# EAGLE design Motherboard V3.1 (EAGLE 6.5.0)

## Sheet 1 of 2: Bank Arbitration and Buss
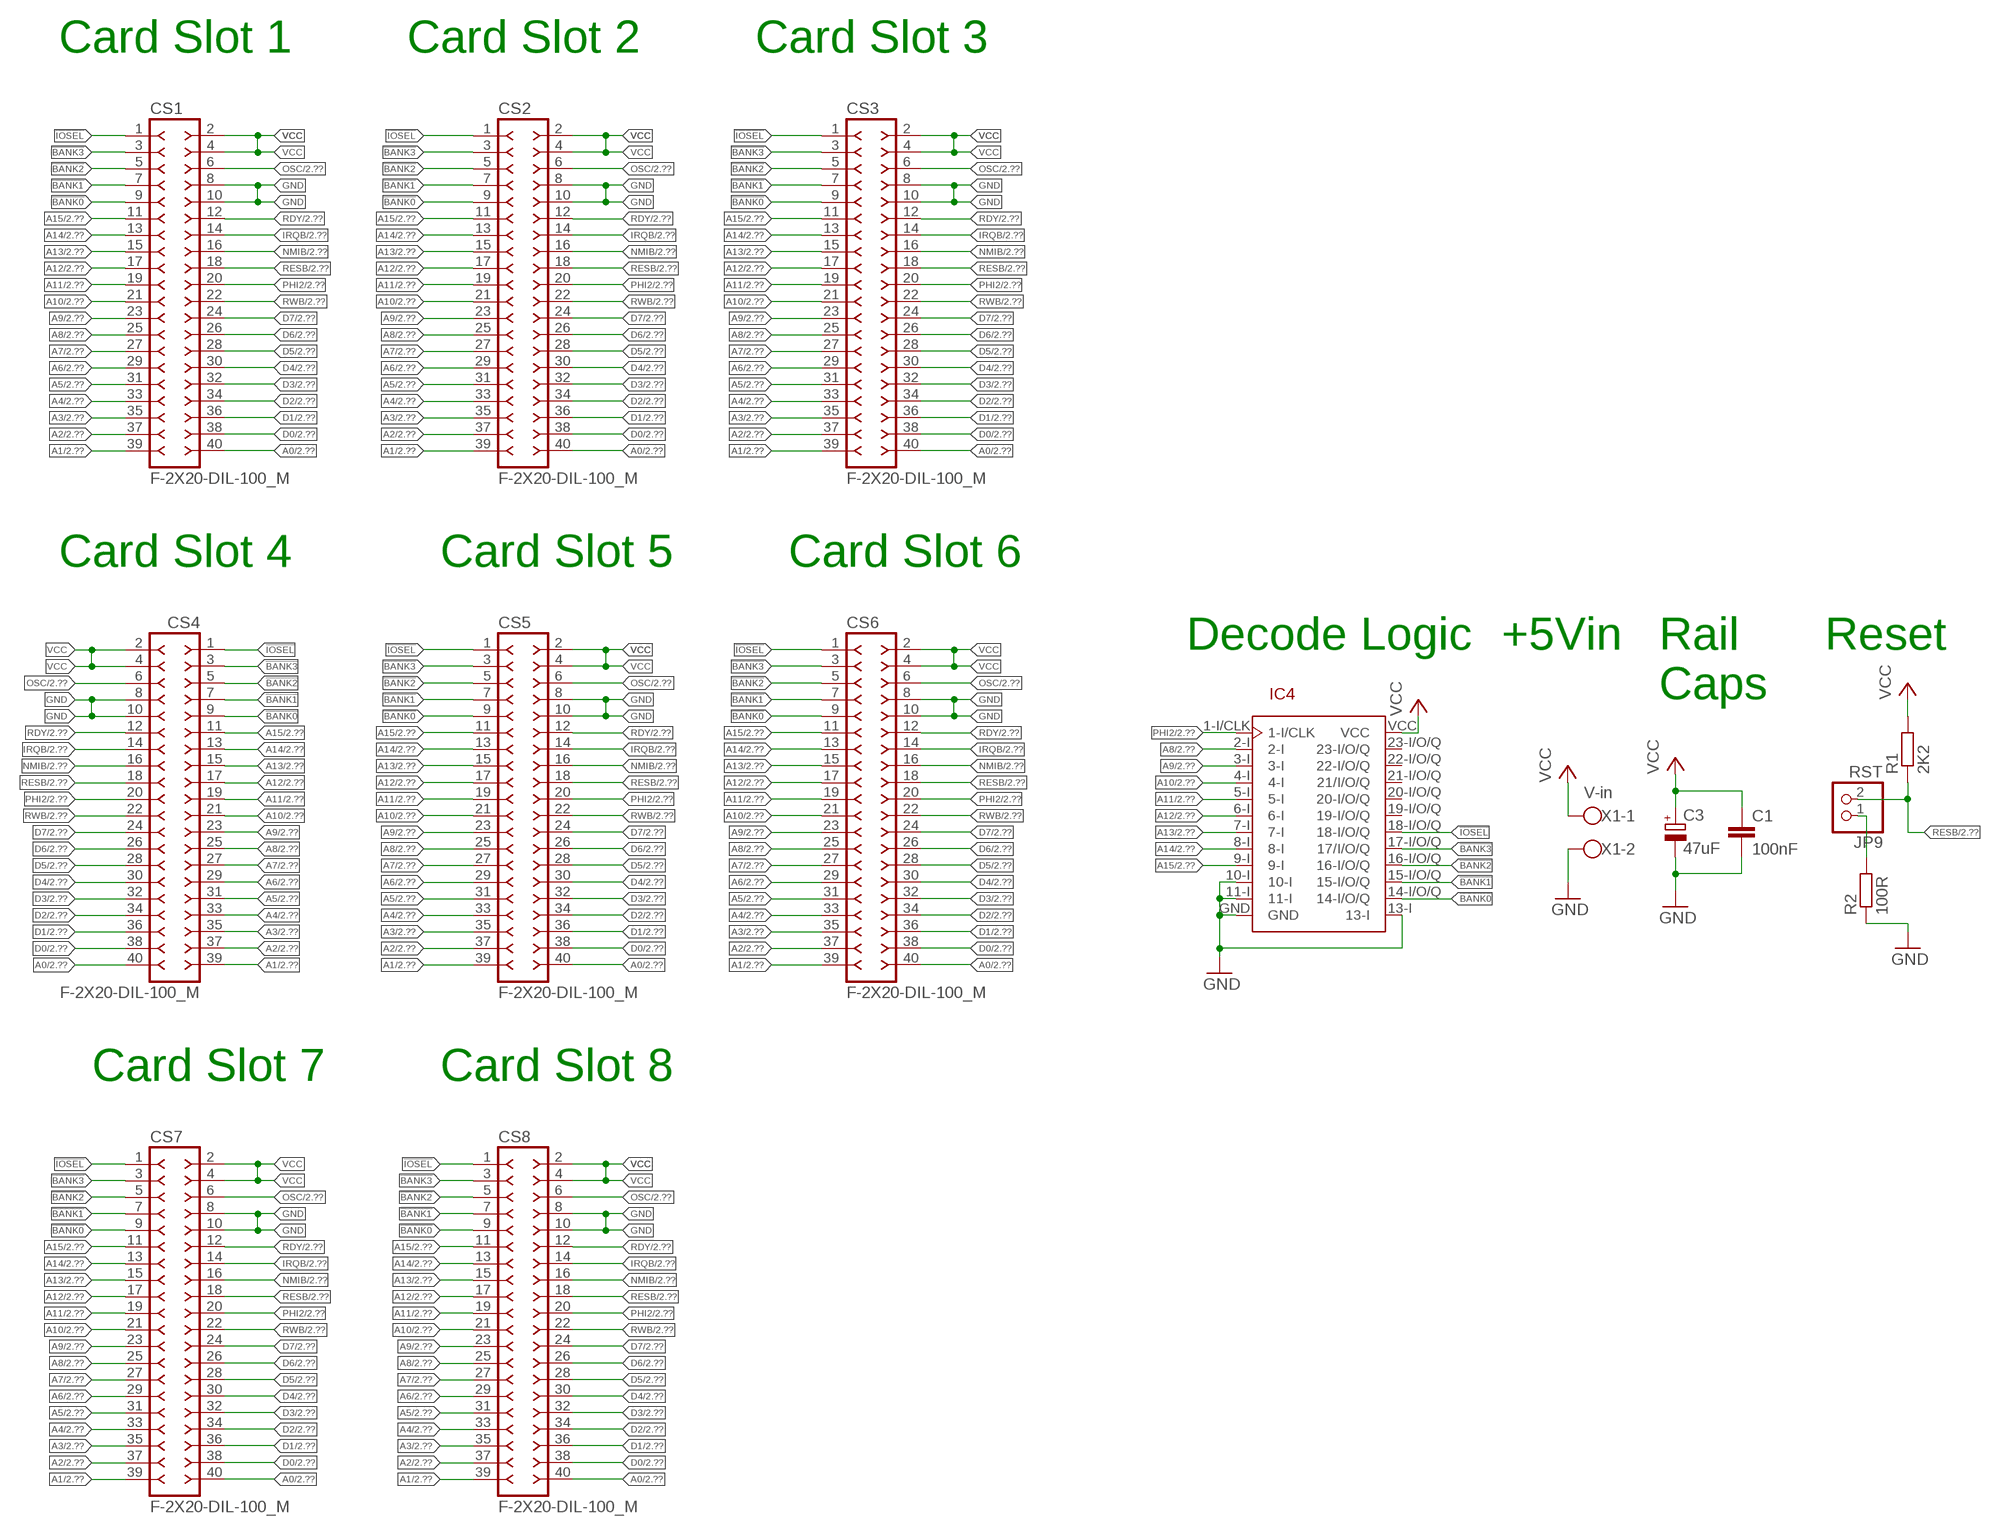
[diagram p0: schematic, sheet 1]

### Parts
C1  100nF  C-EU050-025X075  [C050-025X075]
C3  47uF  CPOL-EUE2.5-7  [E2,5-7]
CS1  F-2X20-DIL-100_M  [DIL-100-2X20_M]
CS2  F-2X20-DIL-100_M  [DIL-100-2X20_M]
CS3  F-2X20-DIL-100_M  [DIL-100-2X20_M]
CS4  F-2X20-DIL-100_M  [DIL-100-2X20_M]
CS5  F-2X20-DIL-100_M  [DIL-100-2X20_M]
CS6  F-2X20-DIL-100_M  [DIL-100-2X20_M]
CS7  F-2X20-DIL-100_M  [DIL-100-2X20_M]
CS8  F-2X20-DIL-100_M  [DIL-100-2X20_M]
IC4  GAL22V10D-7LP  GAL22V10D-DIP  [DIP24]
JP9  RST  PINHD-1X2  [1X02]
R1  2K2  R-EU_0207/10  [0207/10]
R2  100R  R-EU_0207/10  [0207/10]
X1  V-in  W237-102  [W237-102]

### Nets
!BANK0: CS1.9 CS2.9 CS3.9 CS4.9 CS5.9 CS6.9 CS7.9 CS8.9 IC4.14-I/O/Q
!BANK1: CS1.7 CS2.7 CS3.7 CS4.7 CS5.7 CS6.7 CS7.7 CS8.7 IC4.15-I/O/Q
!BANK2: CS1.5 CS2.5 CS3.5 CS4.5 CS5.5 CS6.5 CS7.5 CS8.5 IC4.16-I/O/Q
!BANK3: CS1.3 CS2.3 CS3.3 CS4.3 CS5.3 CS6.3 CS7.3 CS8.3 IC4.17-I/O/Q(17/I/O/Q)
!IOSEL: CS1.1 CS2.1 CS3.1 CS4.1 CS5.1 CS6.1 CS7.1 CS8.1 IC4.18-I/O/Q
A0: CS1.40 CS2.40 CS3.40 CS4.40 CS5.40 CS6.40 CS7.40 CS8.40 ; also sheet 2
A1: CS1.39 CS2.39 CS3.39 CS4.39 CS5.39 CS6.39 CS7.39 CS8.39 ; also sheet 2
A2: CS1.37 CS2.37 CS3.37 CS4.37 CS5.37 CS6.37 CS7.37 CS8.37 ; also sheet 2
A3: CS1.35 CS2.35 CS3.35 CS4.35 CS5.35 CS6.35 CS7.35 CS8.35 ; also sheet 2
A4: CS1.33 CS2.33 CS3.33 CS4.33 CS5.33 CS6.33 CS7.33 CS8.33 ; also sheet 2
A5: CS1.31 CS2.31 CS3.31 CS4.31 CS5.31 CS6.31 CS7.31 CS8.31 ; also sheet 2
A6: CS1.29 CS2.29 CS3.29 CS4.29 CS5.29 CS6.29 CS7.29 CS8.29 ; also sheet 2
A7: CS1.27 CS2.27 CS3.27 CS4.27 CS5.27 CS6.27 CS7.27 CS8.27 ; also sheet 2
A8: CS1.25 CS2.25 CS3.25 CS4.25 CS5.25 CS6.25 CS7.25 CS8.25 IC4.2-I ; also sheet 2
A9: CS1.23 CS2.23 CS3.23 CS4.23 CS5.23 CS6.23 CS7.23 CS8.23 IC4.3-I ; also sheet 2
A10: CS1.21 CS2.21 CS3.21 CS4.21 CS5.21 CS6.21 CS7.21 CS8.21 IC4.4-I ; also sheet 2
A11: CS1.19 CS2.19 CS3.19 CS4.19 CS5.19 CS6.19 CS7.19 CS8.19 IC4.5-I ; also sheet 2
A12: CS1.17 CS2.17 CS3.17 CS4.17 CS5.17 CS6.17 CS7.17 CS8.17 IC4.6-I ; also sheet 2
A13: CS1.15 CS2.15 CS3.15 CS4.15 CS5.15 CS6.15 CS7.15 CS8.15 IC4.7-I ; also sheet 2
A14: CS1.13 CS2.13 CS3.13 CS4.13 CS5.13 CS6.13 CS7.13 CS8.13 IC4.8-I ; also sheet 2
A15: CS1.11 CS2.11 CS3.11 CS4.11 CS5.11 CS6.11 CS7.11 CS8.11 IC4.9-I ; also sheet 2
D0: CS1.38 CS2.38 CS3.38 CS4.38 CS5.38 CS6.38 CS7.38 CS8.38 ; also sheet 2
D1: CS1.36 CS2.36 CS3.36 CS4.36 CS5.36 CS6.36 CS7.36 CS8.36 ; also sheet 2
D2: CS1.34 CS2.34 CS3.34 CS4.34 CS5.34 CS6.34 CS7.34 CS8.34 ; also sheet 2
D3: CS1.32 CS2.32 CS3.32 CS4.32 CS5.32 CS6.32 CS7.32 CS8.32 ; also sheet 2
D4: CS1.30 CS2.30 CS3.30 CS4.30 CS5.30 CS6.30 CS7.30 CS8.30 ; also sheet 2
D5: CS1.28 CS2.28 CS3.28 CS4.28 CS5.28 CS6.28 CS7.28 CS8.28 ; also sheet 2
D6: CS1.26 CS2.26 CS3.26 CS4.26 CS5.26 CS6.26 CS7.26 CS8.26 ; also sheet 2
D7: CS1.24 CS2.24 CS3.24 CS4.24 CS5.24 CS6.24 CS7.24 CS8.24 ; also sheet 2
GND: C1.2 C3.- CS1.8 CS1.10 CS2.8 CS2.10 CS3.8 CS3.10 CS4.8 CS4.10 CS5.8 CS5.10 CS6.8 CS6.10 CS7.8 CS7.10 CS8.8 CS8.10 IC4.10-I IC4.11-I IC4.13-I IC4.GND R2.1 X1.2 ; also sheet 2
IRQB: CS1.14 CS2.14 CS3.14 CS4.14 CS5.14 CS6.14 CS7.14 CS8.14 ; also sheet 2
N$1: JP9.1 R2.2
NMIB: CS1.16 CS2.16 CS3.16 CS4.16 CS5.16 CS6.16 CS7.16 CS8.16 ; also sheet 2
OSC: CS1.6 CS2.6 CS3.6 CS4.6 CS5.6 CS6.6 CS7.6 CS8.6 ; also sheet 2
PHI2: CS1.20 CS2.20 CS3.20 CS4.20 CS5.20 CS6.20 CS7.20 CS8.20 IC4.1-I/CLK ; also sheet 2
RDY: CS1.12 CS2.12 CS3.12 CS4.12 CS5.12 CS6.12 CS7.12 CS8.12 ; also sheet 2
RESB: CS1.18 CS2.18 CS3.18 CS4.18 CS5.18 CS6.18 CS7.18 CS8.18 JP9.2 R1.1 ; also sheet 2
RWB: CS1.22 CS2.22 CS3.22 CS4.22 CS5.22 CS6.22 CS7.22 CS8.22 ; also sheet 2
VCC: C1.1 C3.+ CS1.2 CS1.4 CS2.2 CS2.4 CS3.2 CS3.4 CS4.2 CS4.4 CS5.2 CS5.4 CS6.2 CS6.4 CS7.2 CS7.4 CS8.2 CS8.4 IC4.VCC R1.2 X1.1 ; also sheet 2
Unconnected: IC4.19-I/O/Q IC4.20-I/O/Q IC4.21-I/O/Q(21/I/O/Q) IC4.22-I/O/Q IC4.23-I/O/Q

### Notes on the sheet
- Card Slot 1 | Card Slot 2 | Card Slot 3
- Card Slot 4 | Card Slot 5 | Card Slot 6
- Rail
  Caps
- Decode Logic | +5Vin | Reset
- Card Slot 7 | Card Slot 8

## Sheet 2 of 2: Processr, Clock and IRQ/NMI LED Header
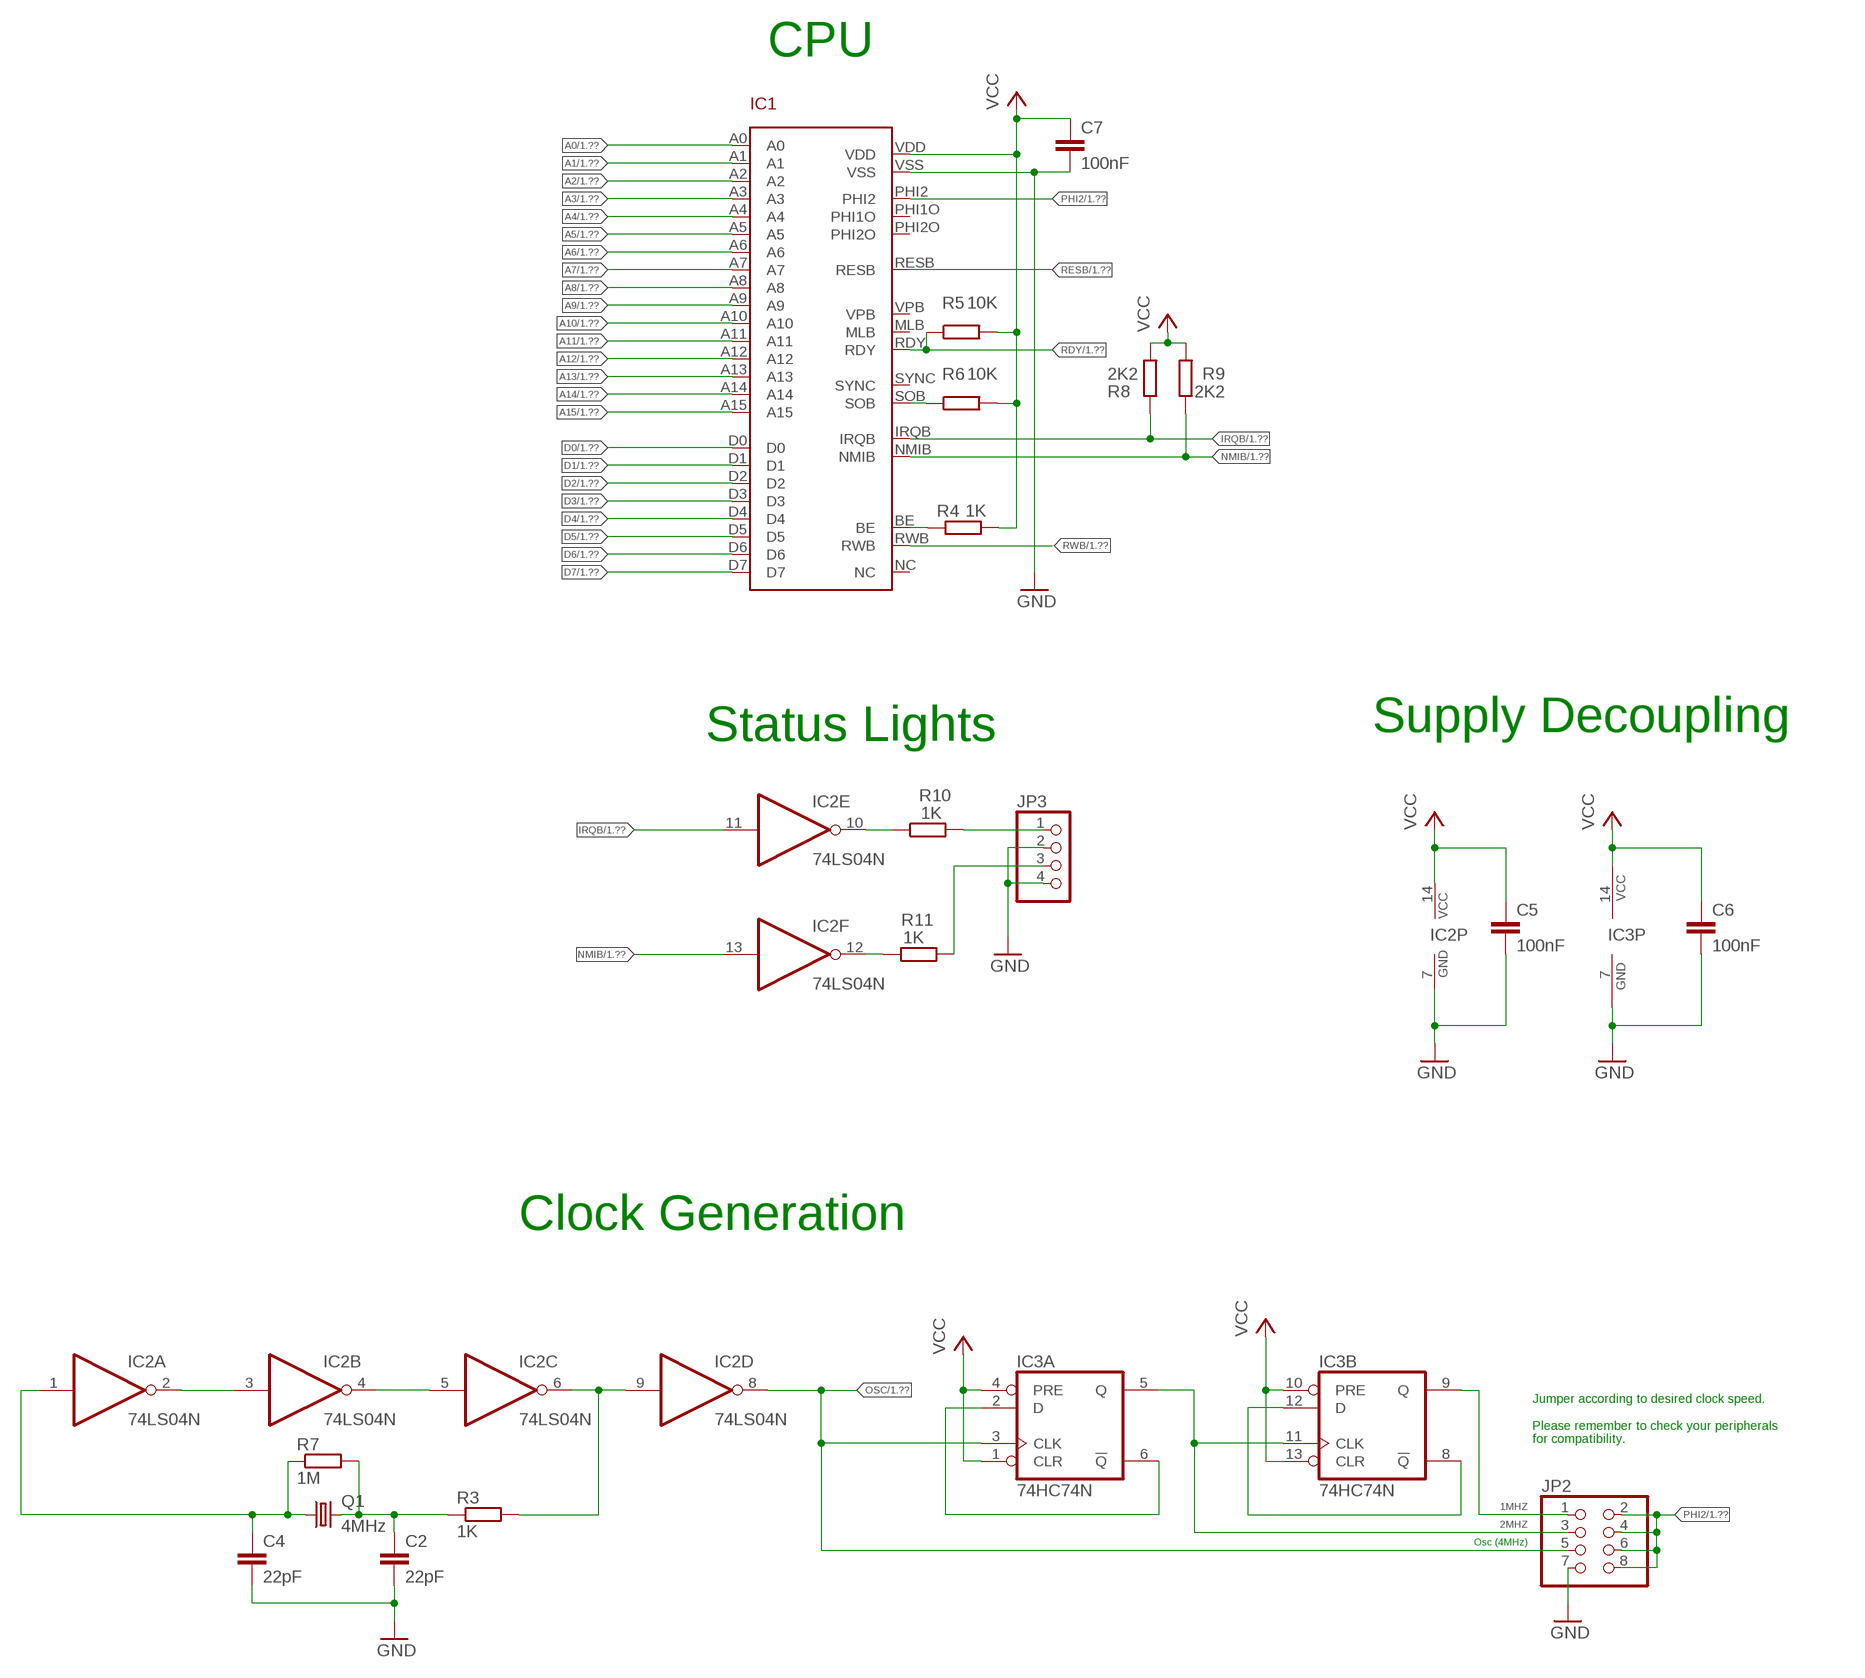
[diagram p1: schematic, sheet 2]

### Parts
C2  22pF  C-EU025-025X050  [C025-025X050]
C4  22pF  C-EU025-025X050  [C025-025X050]
C5  100nF  C-EU050-025X075  [C050-025X075]
C6  100nF  C-EU050-025X075  [C050-025X075]
C7  100nF  C-EU050-025X075  [C050-025X075]
IC1  W65C02S-DIP  [DIP40]
IC2  74LS04N  74HC04N  [DIL14]
IC3  74HC74N  74LS74N  [DIL14]
JP2  PINHD-2X4  [2X04]
JP3  PINHD-1X4  [1X04]
Q1  4MHz  CRYSTALHC49S  [HC49/S]
R3  1K  R-EU_0207/2V  [0207/2V]
R4  1K  R-EU_0207/10  [0207/10]
R5  10K  R-EU_0207/2V  [0207/2V]
R6  10K  R-EU_0207/10  [0207/10]
R7  1M  R-EU_0207/2V  [0207/2V]
R8  2K2  R-EU_0207/2V  [0207/2V]
R9  2K2  R-EU_0207/2V  [0207/2V]
R10  1K  R-EU_0207/2V  [0207/2V]
R11  1K  R-EU_0207/2V  [0207/2V]

### Nets
1MHZ: IC3.9(B:Q) JP2.1
2MHZ: IC3.5(A:Q) IC3.11(B:CLK) JP2.3
A0: IC1.A0 ; also sheet 1
A1: IC1.A1 ; also sheet 1
A2: IC1.A2 ; also sheet 1
A3: IC1.A3 ; also sheet 1
A4: IC1.A4 ; also sheet 1
A5: IC1.A5 ; also sheet 1
A6: IC1.A6 ; also sheet 1
A7: IC1.A7 ; also sheet 1
A8: IC1.A8 ; also sheet 1
A9: IC1.A9 ; also sheet 1
A10: IC1.A10 ; also sheet 1
A11: IC1.A11 ; also sheet 1
A12: IC1.A12 ; also sheet 1
A13: IC1.A13 ; also sheet 1
A14: IC1.A14 ; also sheet 1
A15: IC1.A15 ; also sheet 1
D0: IC1.D0 ; also sheet 1
D1: IC1.D1 ; also sheet 1
D2: IC1.D2 ; also sheet 1
D3: IC1.D3 ; also sheet 1
D4: IC1.D4 ; also sheet 1
D5: IC1.D5 ; also sheet 1
D6: IC1.D6 ; also sheet 1
D7: IC1.D7 ; also sheet 1
GND: C2.2 C4.2 C5.2 C6.2 C7.2 IC1.VSS IC2.7(P:GND) IC3.7(P:GND) JP2.7 JP3.2 JP3.4 ; also sheet 1
IRQ_LED: JP3.1 R10.2
IRQ_SIG: IC2.10(E:O) R10.1
IRQB: IC1.IRQB IC2.11(E:I) R8.1 ; also sheet 1
N$2: IC2.4(B:O) IC2.5(C:I)
N$3: IC2.6(C:O) IC2.9(D:I) R3.2
N$4: C2.1 Q1.2 R3.1 R7.2
N$5: C4.1 IC2.1(A:I) Q1.1 R7.1
N$6: IC3.2(A:D) IC3.6(A:!Q)
N$7: IC2.2(A:O) IC2.3(B:I)
N$8: IC3.8(B:!Q) IC3.12(B:D)
N$15: IC1.BE R4.1
N$16: IC1.SOB R6.1
NMI_LED: JP3.3 R11.2
NMI_SIG: IC2.12(F:O) R11.1
NMIB: IC1.NMIB IC2.13(F:I) R9.1 ; also sheet 1
OSC: IC2.8(D:O) IC3.3(A:CLK) JP2.5 ; also sheet 1
PHI2: IC1.PHI2 JP2.2 JP2.4 JP2.6 JP2.8 ; also sheet 1
RDY: IC1.RDY R5.1 ; also sheet 1
RESB: IC1.RESB ; also sheet 1
RWB: IC1.RWB ; also sheet 1
VCC: C5.1 C6.1 C7.1 IC1.VDD IC2.14(P:VCC) IC3.1(A:CLR) IC3.4(A:PRE) IC3.10(B:PRE) IC3.13(B:CLR) IC3.14(P:VCC) R4.2 R5.2 R6.2 R8.2 R9.2 ; also sheet 1
Unconnected: IC1.MLB IC1.NC IC1.PHI1O IC1.PHI2O IC1.SYNC IC1.VPB

### Notes on the sheet
- CPU
- Status Lights | Supply Decoupling
- Clock Generation
- Jumper according to desired clock speed.
  
  Please remember to check your peripherals
  for compatibility.
- Osc (4MHz)

## Library data of the parts
C1 C2 C4-C7 = rcl:C-EU: CAPACITOR, European symbol
C3 = rcl:CPOL-EU: POLARIZED CAPACITOR, European symbol
CS1-CS8 = con-headers-jp:F-2X20-: FEMALE HEADER
IC1 = W65C02S:W65C02S-DIP
IC2 = 74xx-eu:74*04: Hex INVERTER
IC3 = 74xx-us:74*74: Dual D type positive edge triggered FLIP FLOP, preset and clear
IC4 = GAL22V10D:GAL22V10D-DIP: GAL22V10 Generic Array Logic
JP2 = pinhead:PINHD-2X4: PIN HEADER
JP3 = pinhead:PINHD-1X4: PIN HEADER
JP9 = pinhead:PINHD-1X2: PIN HEADER
Q1 = crystal:CRYSTAL: CRYSTAL; OC_FARNELL: 1667008; OC_NEWARK: unknown
R1-R11 = rcl:R-EU_: RESISTOR, European symbol
X1 = con-wago-500:W237-102: WAGO SCREW CLAMP; MPN: 237-102; OC_FARNELL: unknown; OC_NEWARK: 70K9898

## Board
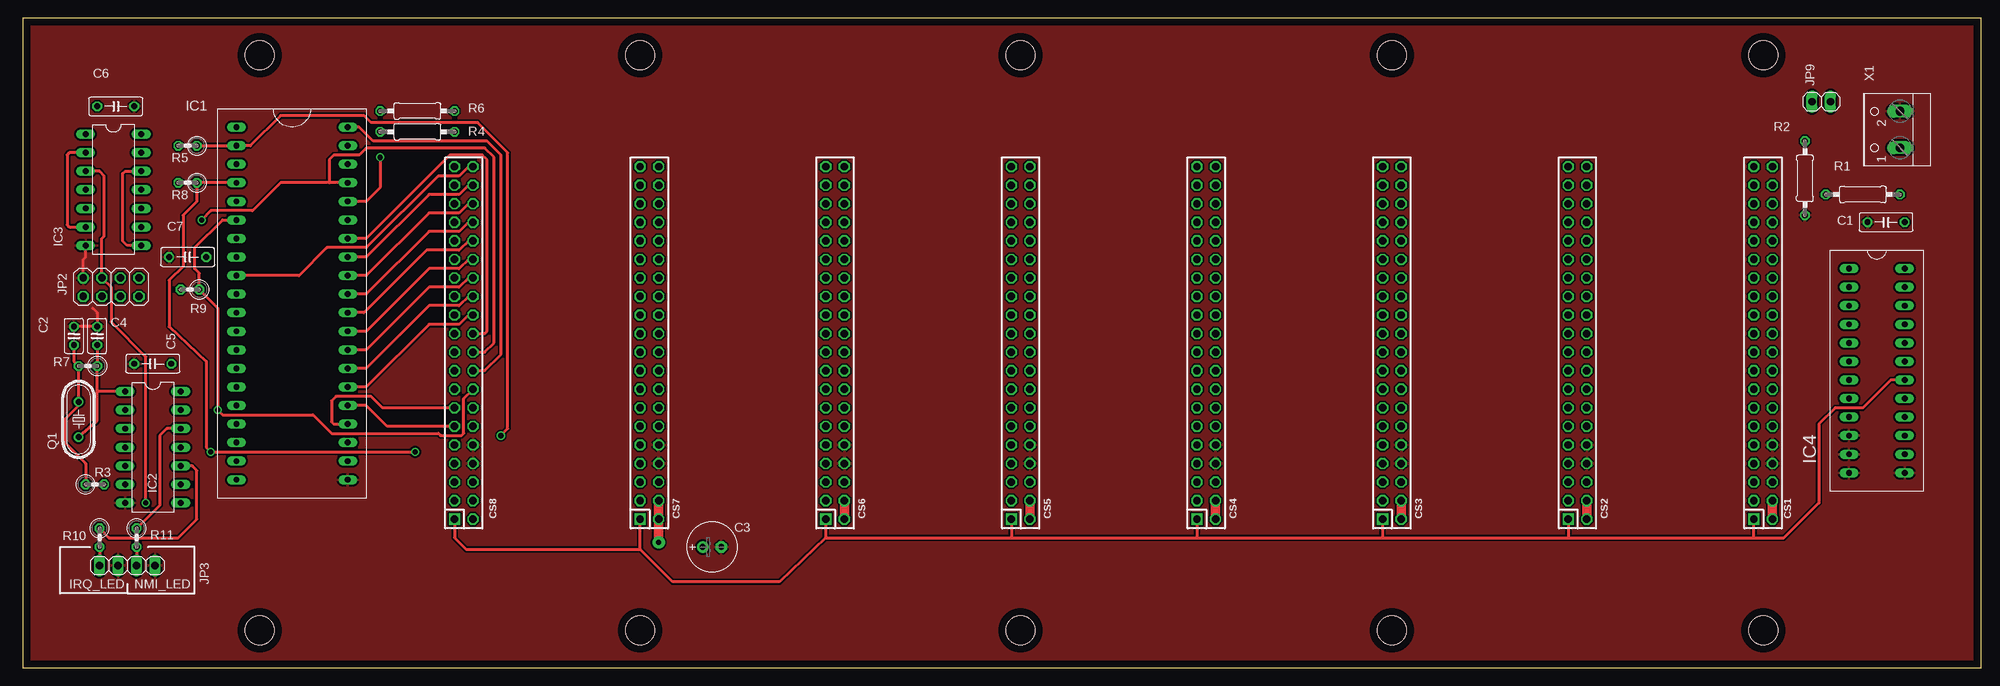
[diagram p2: board, top side]
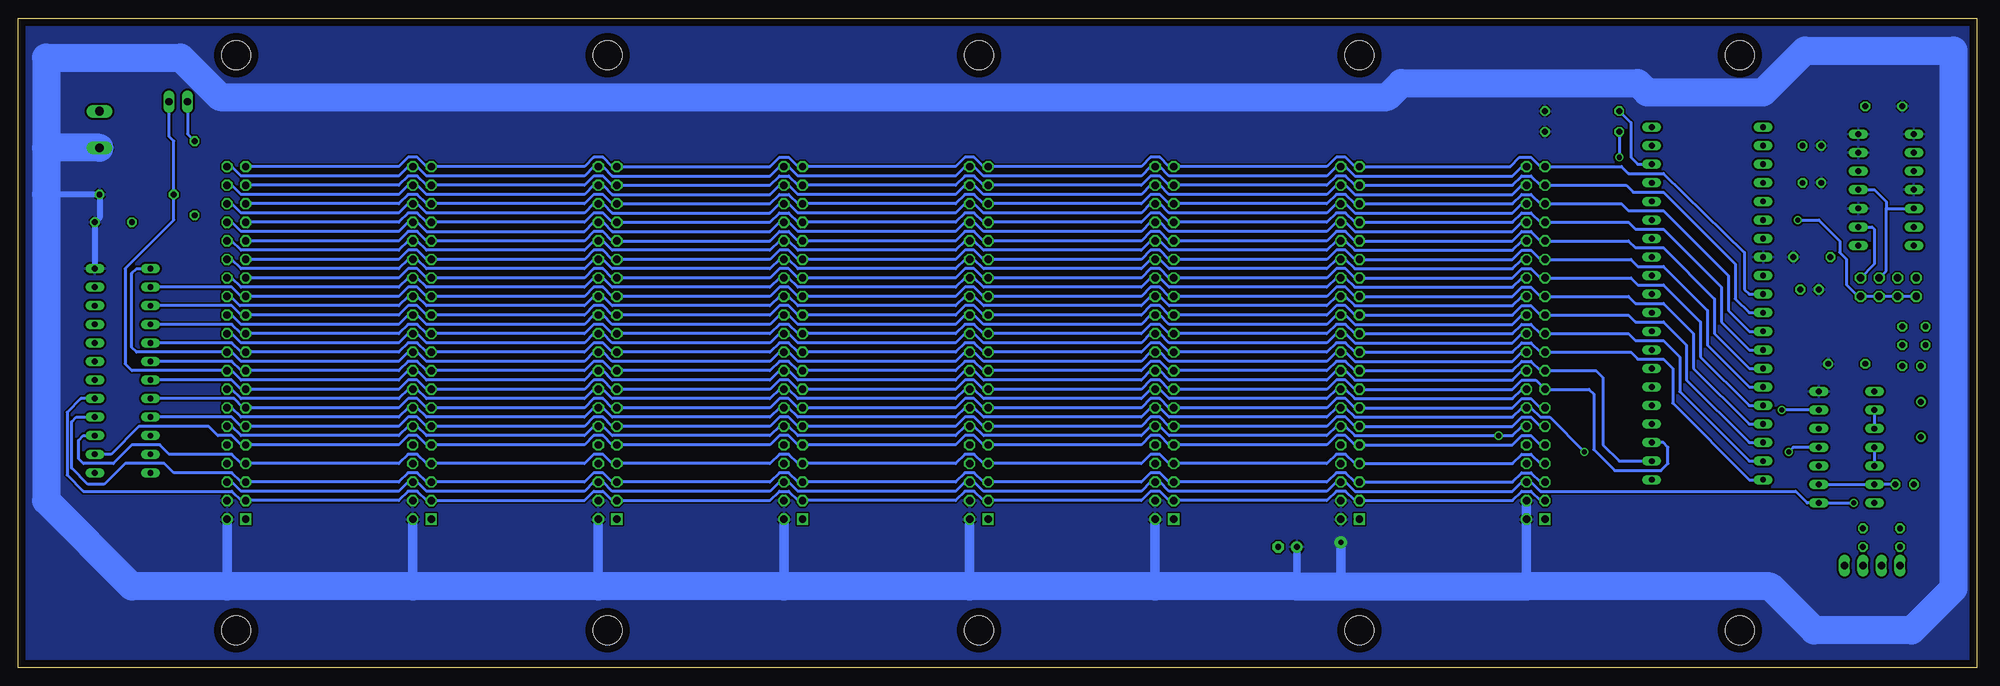
[diagram p3: board, bottom side, seen from below]

Size 267.96 x 88.89 mm. Coordinates in mm from the lower left corner, seen from the top.
Outline: 0,0 267.96,0 267.96,88.89 0,88.89 0,0
Copper layers (1*16): Top 0.07mm / dielectric 1.5mm / Bottom 0.07mm
Design rules "default *": minimum track width 10mil, minimum drill 24mil, track to track 8mil, track to pad 8mil, pad to pad 8mil, via to via 8mil, smd to smd 8mil, copper to edge 40mil, drill to drill 8mil, minimum pad ring 10mil, minimum via ring 8mil, stop-mask expansion 4mil, vias tented up to drill 0mil, thermal gap 10mil
Holes 4 mm at 84.45,5.08 84.45,83.82 238.12,83.82 238.12,5.08 136.53,5.08 136.53,83.82 187.32,5.08 187.32,83.82 84.45,5.08 32.38,5.08 32.38,83.82

### Footprints (pad centres in the part's own frame; a part is rotated, then mirrored left to right if it is on the bottom)
C050-025X075 = drill 0.813 octagon: 1 -2.54,0; 2 2.54,0
C025-025X050 = drill 0.813 octagon: 1 -1.27,0; 2 1.27,0
E2,5-7 = drill 0.813 pad 1.6: + -1.27,0 | drill 0.813 pad 1.6 octagon: - 1.27,0
DIL-100-2X20_M = drill 1.016 square: 1 -24.13,1.27 | drill 1.016 octagon: 2 -24.13,-1.27; 3 -21.59,1.27; 4 -21.59,-1.27; 5 -19.05,1.27; 6 -19.05,-1.27; 7 -16.51,1.27; 8 -16.51,-1.27; 9 -13.97,1.27; 10 -13.97,-1.27; 11 -11.43,1.27; 12 -11.43,-1.27; 13 -8.89,1.27; 14 -8.89,-1.27; 15 -6.35,1.27; 16 -6.35,-1.27; 17 -3.81,1.27; 18 -3.81,-1.27; 19 -1.27,1.27; 20 -1.27,-1.27; 21 1.27,1.27; 22 1.27,-1.27; 23 3.81,1.27; 24 3.81,-1.27; 25 6.35,1.27; 26 6.35,-1.27; 27 8.89,1.27; 28 8.89,-1.27; 29 11.43,1.27; 30 11.43,-1.27; 31 13.97,1.27; 32 13.97,-1.27; 33 16.51,1.27; 34 16.51,-1.27; 35 19.05,1.27; 36 19.05,-1.27; 37 21.59,1.27; 38 21.59,-1.27; 39 24.13,1.27; 40 24.13,-1.27
DIP40 = drill 0.8 long: A0 -7.62,3.81; A1 -7.62,1.27; A2 -7.62,-1.27; A3 -7.62,-3.81; A4 -7.62,-6.35; A5 -7.62,-8.89; A6 -7.62,-11.43; A7 -7.62,-13.97; A8 -7.62,-16.51; A9 -7.62,-19.05; A10 -7.62,-21.59; A11 -7.62,-24.13; A12 7.62,-21.59; A13 7.62,-19.05; A14 7.62,-16.51; A15 7.62,-13.97; BE 7.62,13.97; D0 7.62,6.35; D1 7.62,3.81; D2 7.62,1.27; D3 7.62,-1.27; D4 7.62,-3.81; D5 7.62,-6.35; D6 7.62,-8.89; D7 7.62,-11.43; IRQB -7.62,16.51; MLB -7.62,13.97; NC 7.62,11.43; NMIB -7.62,11.43; PHI1O -7.62,19.05; PHI2 7.62,16.51; PHI2O 7.62,21.59; RDY -7.62,21.59; RESB 7.62,24.13; RWB 7.62,8.89; SOB 7.62,19.05; SYNC -7.62,8.89; VDD -7.62,6.35; VPB -7.62,24.13; VSS 7.62,-24.13
DIL14 = drill 0.813 long: 1 -7.62,-3.81; 2 -5.08,-3.81; 3 -2.54,-3.81; 4 0,-3.81; 5 2.54,-3.81; 6 5.08,-3.81; 7 7.62,-3.81; 8 7.62,3.81; 9 5.08,3.81; 10 2.54,3.81; 11 0,3.81; 12 -2.54,3.81; 13 -5.08,3.81; 14 -7.62,3.81
DIP24 = drill 0.8 long: 1-I/CLK -3.81,13.97; 2-I -3.81,11.43; 3-I -3.81,8.89; 4-I -3.81,6.35; 5-I -3.81,3.81; 6-I -3.81,1.27; 7-I -3.81,-1.27; 8-I -3.81,-3.81; 9-I -3.81,-6.35; 10-I -3.81,-8.89; 11-I -3.81,-11.43; 13-I 3.81,-13.97; 14-I/O/Q 3.81,-11.43; 15-I/O/Q 3.81,-8.89; 16-I/O/Q 3.81,-6.35; 17-I/O/Q 3.81,-3.81; 18-I/O/Q 3.81,-1.27; 19-I/O/Q 3.81,1.27; 20-I/O/Q 3.81,3.81; 21-I/O/Q 3.81,6.35; 22-I/O/Q 3.81,8.89; 23-I/O/Q 3.81,11.43; GND -3.81,-13.97; VCC 3.81,13.97
2X04 = drill 1.016 octagon: 1 -3.81,-1.27; 2 -3.81,1.27; 3 -1.27,-1.27; 4 -1.27,1.27; 5 1.27,-1.27; 6 1.27,1.27; 7 3.81,-1.27; 8 3.81,1.27
1X04 = drill 1.016 long: 1 -3.81,0; 2 -1.27,0; 3 1.27,0; 4 3.81,0
1X02 = drill 1.016 long: 1 -1.27,0; 2 1.27,0
HC49/S = drill 0.813: 1 -2.413,0; 2 2.413,0
0207/10 = drill 0.813 octagon: 1 -5.08,0; 2 5.08,0
0207/2V = drill 0.813 octagon: 1 -1.27,0; 2 1.27,0
W237-102 = drill 1.194 long: 1 -2.5,-1.27; 2 2.5,-1.27

### Placement (x,y rotation side)
C1  254.95,60.96 180 top
C2  6.99,45.4 90 top
C3  94.3,16.51 0 top
C4  10.16,45.4 90 top
C5  17.78,41.59 180 top
C6  12.7,76.83 0 top
C7  22.54,56.2 180 top
CS1  238.12,44.45 90 top
CS2  212.72,44.45 90 top
CS3  187.32,44.45 90 top
CS4  161.93,44.45 90 top
CS5  136.53,44.45 90 top
CS6  111.12,44.45 90 top
CS7  85.72,44.45 90 top
CS8  60.33,44.45 90 top
IC1  36.83,49.85 0 top
IC2  17.78,30.16 270 top
IC3  12.38,65.41 270 top
IC4  253.68,40.64 0 top
JP2  12.06,52.07 180 top
JP3  14.29,13.97 0 top
JP9  246.06,77.47 0 top
Q1  7.62,33.97 90 top
R1  251.78,64.77 0 top
R2  243.84,66.99 90 top
R3  9.84,25.08 0 top
R4  53.98,73.34 0 top
R5  22.54,71.44 180 top
R6  53.98,76.2 0 top
R7  8.89,41.27 180 top
R8  22.54,66.36 180 top
R9  22.86,51.75 180 top
R10  10.48,17.78 270 top
R11  15.56,17.78 270 top
X1  255.59,73.66 90 top

### Tracks (layer width: path | path; a pad name or v marks a point on that pad's centre or on a via)
1MHZ
  Bottom 0.406: IC3.9 14.29,60.33 13.97,60.01 13.97,55.24 JP2.1
2MHZ
  Bottom 0.406: 12.38,62.87 IC3.5 | IC3.11 13.97,65.41 12.38,63.82 12.38,62.87 | JP2.3 12.38,54.29 12.38,62.87
!BANK0
  Bottom 0.406: IC4.14-I/O/Q 255.27,29.21 251.46,33.02 241.94,33.02 240.66,31.75 238.76,31.75 237.49,30.48 CS1.9 215.9,30.48 214.63,31.75 213.36,31.75 212.09,30.48 CS2.9 190.5,30.48 189.23,31.75 187.96,31.75 186.69,30.48 CS3.9 165.1,30.48 163.83,31.75 162.56,31.75 161.29,30.48 CS4.9 139.7,30.48 138.43,31.75 137.16,31.75 135.89,30.48 CS5.9 114.3,30.48 113.03,31.75 111.76,31.75 110.49,30.48 CS6.9 88.9,30.48 87.63,31.75 86.36,31.75 85.09,30.48 CS7.9 63.5,30.48 62.23,31.75 60.96,31.75 59.69,30.48 CS8.9
!BANK1
  Bottom 0.406: IC4.15-I/O/Q 259.08,31.75 259.71,31.11 259.71,28.57 259.08,27.94 254.95,27.94 252.41,30.48 248.6,30.48 247.33,29.21 238.76,29.21 237.49,27.94 CS1.7 215.9,27.94 214.63,29.21 213.36,29.21 212.09,27.94 CS2.7 190.5,27.94 189.23,29.21 187.96,29.21 186.69,27.94 CS3.7 165.1,27.94 163.83,29.21 162.56,29.21 161.29,27.94 CS4.7 139.7,27.94 138.43,29.21 137.16,29.21 135.89,27.94 CS5.7 114.3,27.94 113.03,29.21 111.76,29.21 110.49,27.94 CS6.7 88.9,27.94 87.63,29.21 86.36,29.21 85.09,27.94 CS7.7 63.5,27.94 62.23,29.21 60.96,29.21 59.69,27.94 CS8.7
!BANK2
  Bottom 0.406: IC4.16-I/O/Q 260.03,34.29 260.67,33.66 260.67,27.3 258.44,25.08 256.22,25.08 253.37,27.94 247.97,27.94 246.7,26.67 238.76,26.67 237.49,25.4 CS1.5 215.9,25.4 214.63,26.67 213.36,26.67 212.09,25.4 CS2.5 190.5,25.4 189.23,26.67 187.96,26.67 186.69,25.4 CS3.5 165.1,25.4 163.83,26.67 162.56,26.67 161.29,25.4 CS4.5 139.7,25.4 138.43,26.67 137.16,26.67 135.89,25.4 CS5.5 114.3,25.4 113.03,26.67 111.76,26.67 110.49,25.4 CS6.5 88.9,25.4 87.63,26.67 86.36,26.67 85.09,25.4 CS7.5 63.5,25.4 62.23,26.67 60.96,26.67 59.69,25.4 CS8.5
!BANK3
  Bottom 0.406: IC4.17-I/O/Q 259.4,36.83 261.3,34.92 261.3,26.35 259.08,24.13 238.76,24.13 237.49,22.86 CS1.3 215.9,22.86 214.63,24.13 213.36,24.13 212.09,22.86 CS2.3 190.5,22.86 189.23,24.13 187.96,24.13 186.69,22.86 CS3.3 165.1,22.86 163.83,24.13 162.56,24.13 161.29,22.86 CS4.3 139.7,22.86 138.43,24.13 137.16,24.13 135.89,22.86 CS5.3 114.3,22.86 113.03,24.13 111.76,24.13 110.49,22.86 CS6.3 88.9,22.86 87.63,24.13 86.36,24.13 85.09,22.86 CS7.3 63.5,22.86 62.23,24.13 60.96,24.13 59.69,22.86 CS8.3
!IOSEL
  Top 0.406: CS6.1 109.86,17.78 | 109.86,17.78 135.25,17.78 | 135.25,17.78 160.66,17.78 | 160.66,17.78 186.06,17.78 | 186.06,17.78 211.46,17.78 | 211.46,17.78 236.85,17.78 | 236.85,17.78 CS1.1 | CS2.1 211.46,17.78 | CS3.1 186.06,17.78 | CS4.1 160.66,17.78 | CS5.1 135.25,17.78 | 109.86,17.78 103.5,11.75 88.9,11.75 84.45,16.19 | 84.45,16.19 CS7.1 | 236.85,17.78 240.98,17.78 245.75,22.54 245.75,33.34 247.97,35.56 251.78,35.56 255.59,39.37 IC4.18-I/O/Q | CS8.1 59.05,17.78 60.64,16.19 84.45,16.19
A0
  Top 0.406: CS8.40 60.96,68.58 59.69,67.31 56.83,67.31 46.99,57.47 41.59,57.47 37.78,53.66 IC1.A0
  Bottom 0.406: CS1.40 238.76,68.58 237.49,67.31 215.9,67.31 214.63,68.58 CS2.40 213.36,68.58 212.09,67.31 190.5,67.31 189.23,68.58 CS3.40 187.96,68.58 186.69,67.31 165.1,67.31 163.83,68.58 CS4.40 162.56,68.58 161.29,67.31 139.7,67.31 138.43,68.58 CS5.40 137.16,68.58 135.89,67.31 114.3,67.31 113.03,68.58 CS6.40 111.76,68.58 110.49,67.31 88.9,67.31 87.63,68.58 CS7.40 86.36,68.58 85.09,67.31 63.5,67.31 62.23,68.58 CS8.40
A1
  Bottom 0.406: CS1.39 215.9,68.58 214.63,69.85 213.36,69.85 212.09,68.58 CS2.39 190.5,68.58 189.23,69.85 187.96,69.85 186.69,68.58 CS3.39 165.1,68.58 163.83,69.85 162.56,69.85 161.29,68.58 CS4.39 139.7,68.58 138.43,69.85 137.16,69.85 135.89,68.58 CS5.39 114.3,68.58 113.03,69.85 111.76,69.85 110.49,68.58 CS6.39 88.9,68.58 87.63,69.85 86.36,69.85 85.09,68.58 CS7.39 63.82,68.58 62.55,69.85 60.96,69.85 59.69,68.58 CS8.39 48.58,68.58 47.62,67.63 42.86,67.63 31.75,56.83 31.75,51.75 31.11,51.12 IC1.A1
A2
  Bottom 0.406: CS1.37 215.9,66.04 214.63,67.31 213.36,67.31 212.09,66.04 CS2.37 190.5,66.04 189.23,67.31 187.96,67.31 186.69,66.04 CS3.37 165.1,66.04 163.83,67.31 162.56,67.31 161.29,66.04 CS4.37 139.7,66.04 138.43,67.31 137.16,67.31 135.89,66.04 CS5.37 114.3,66.04 113.03,67.31 111.76,67.31 110.49,66.04 CS6.37 88.9,66.04 87.63,67.31 86.36,67.31 85.09,66.04 CS7.37 63.5,66.04 62.23,67.31 60.96,67.31 59.69,66.04 CS8.37 47.94,66.04 46.99,65.09 42.86,65.09 33.02,55.24 33.02,50.48 31.11,48.58 IC1.A2
A3
  Bottom 0.406: CS1.35 215.9,63.5 214.63,64.77 213.36,64.77 212.09,63.5 CS2.35 190.5,63.5 189.23,64.77 187.96,64.77 186.69,63.5 CS3.35 165.1,63.5 163.83,64.77 162.56,64.77 161.29,63.5 CS4.35 139.7,63.5 138.43,64.77 137.16,64.77 135.89,63.5 CS5.35 114.3,63.5 113.03,64.77 111.76,64.77 110.49,63.5 CS6.35 88.9,63.5 87.63,64.77 86.36,64.77 85.09,63.5 CS7.35 63.5,63.5 62.23,64.77 60.96,64.77 59.69,63.5 CS8.35 48.58,63.5 47.62,62.55 42.86,62.55 33.97,53.66 33.97,48.9 31.11,46.04 IC1.A3
A4
  Bottom 0.406: CS1.33 215.9,60.96 214.63,62.23 213.36,62.23 212.09,60.96 CS2.33 190.5,60.96 189.23,62.23 187.96,62.23 186.69,60.96 CS3.33 165.1,60.96 163.83,62.23 162.56,62.23 161.29,60.96 CS4.33 139.7,60.96 138.43,62.23 137.16,62.23 135.89,60.96 CS5.33 114.3,60.96 113.03,62.23 111.76,62.23 110.49,60.96 CS6.33 88.9,60.96 87.63,62.23 86.36,62.23 85.09,60.96 CS7.33 63.5,60.96 62.23,62.23 60.96,62.23 59.69,60.96 CS8.33 47.62,60.96 46.67,60.01 42.86,60.01 34.92,52.07 34.92,47.31 31.11,43.5 IC1.A4
A5
  Bottom 0.406: CS1.31 215.9,58.42 214.63,59.69 213.36,59.69 212.09,58.42 CS2.31 190.5,58.42 189.23,59.69 187.96,59.69 186.69,58.42 CS3.31 165.1,58.42 163.83,59.69 162.56,59.69 161.29,58.42 CS4.31 139.7,58.42 138.43,59.69 137.16,59.69 135.89,58.42 CS5.31 114.3,58.42 113.03,59.69 111.76,59.69 110.49,58.42 CS6.31 88.9,58.42 87.63,59.69 86.36,59.69 85.09,58.42 CS7.31 63.5,58.42 62.23,59.69 60.96,59.69 59.69,58.42 CS8.31 47.62,58.42 46.67,57.47 42.86,57.47 35.88,50.48 35.88,45.72 31.11,40.96 IC1.A5
A6
  Bottom 0.406: CS1.29 215.9,55.88 214.63,57.15 213.36,57.15 212.09,55.88 CS2.29 190.5,55.88 189.23,57.15 187.96,57.15 186.69,55.88 CS3.29 165.1,55.88 163.83,57.15 162.56,57.15 161.29,55.88 CS4.29 139.7,55.88 138.43,57.15 137.16,57.15 135.89,55.88 CS5.29 114.3,55.88 113.03,57.15 111.76,57.15 110.49,55.88 CS6.29 88.9,55.88 87.63,57.15 86.36,57.15 85.09,55.88 CS7.29 63.5,55.88 62.23,57.15 60.96,57.15 59.69,55.88 CS8.29 47.31,55.88 46.35,54.93 42.86,54.93 36.83,48.9 36.83,44.13 31.11,38.42 IC1.A6
A7
  Bottom 0.406: CS1.27 215.9,53.34 214.63,54.61 213.36,54.61 212.09,53.34 CS2.27 190.5,53.34 189.23,54.61 187.96,54.61 186.69,53.34 CS3.27 165.1,53.34 163.83,54.61 162.56,54.61 161.29,53.34 CS4.27 139.7,53.34 138.43,54.61 137.16,54.61 135.89,53.34 CS5.27 114.3,53.34 113.03,54.61 111.76,54.61 110.49,53.34 CS6.27 88.9,53.34 87.63,54.61 86.36,54.61 85.09,53.34 CS7.27 63.5,53.34 62.23,54.61 60.96,54.61 59.69,53.34 CS8.27 47.31,53.34 46.35,52.39 42.86,52.39 37.78,47.31 37.78,42.55 31.11,35.88 IC1.A7
A8
  Bottom 0.406: IC4.2-I 238.76,52.07 237.49,50.8 CS1.25 215.9,50.8 214.63,52.07 213.36,52.07 212.09,50.8 CS2.25 190.5,50.8 189.23,52.07 187.96,52.07 186.69,50.8 CS3.25 165.1,50.8 163.83,52.07 162.56,52.07 161.29,50.8 CS4.25 139.7,50.8 138.43,52.07 137.16,52.07 135.89,50.8 CS5.25 114.3,50.8 113.03,52.07 111.76,52.07 110.49,50.8 CS6.25 88.9,50.8 87.63,52.07 86.36,52.07 85.09,50.8 CS7.25 63.5,50.8 62.23,52.07 60.96,52.07 59.69,50.8 CS8.25 47.62,50.8 46.67,49.85 42.86,49.85 38.73,45.72 38.73,40.96 31.11,33.34 IC1.A8
A9
  Bottom 0.406: IC4.3-I 238.76,49.53 237.49,48.26 CS1.23 215.9,48.26 214.63,49.53 213.36,49.53 212.09,48.26 CS2.23 190.5,48.26 189.23,49.53 187.96,49.53 186.69,48.26 CS3.23 165.1,48.26 163.83,49.53 162.56,49.53 161.29,48.26 CS4.23 139.7,48.26 138.43,49.53 137.16,49.53 135.89,48.26 CS5.23 114.3,48.26 113.03,49.53 111.76,49.53 110.49,48.26 CS6.23 88.9,48.26 87.63,49.53 86.36,49.53 85.09,48.26 CS7.23 63.5,48.26 62.23,49.53 60.96,49.53 59.69,48.26 CS8.23 47.62,48.26 46.67,47.31 42.86,47.31 39.69,44.13 39.69,39.37 31.11,30.8 IC1.A9
A10
  Bottom 0.406: IC4.4-I 238.76,46.99 237.49,45.72 CS1.21 215.9,45.72 214.63,46.99 213.36,46.99 212.09,45.72 CS2.21 190.5,45.72 189.23,46.99 187.96,46.99 186.69,45.72 CS3.21 165.1,45.72 163.83,46.99 162.56,46.99 161.29,45.72 CS4.21 139.7,45.72 138.43,46.99 137.16,46.99 135.89,45.72 CS5.21 114.3,45.72 113.03,46.99 111.76,46.99 110.49,45.72 CS6.21 88.9,45.72 87.63,46.99 86.36,46.99 85.09,45.72 CS7.21 63.5,45.72 62.23,46.99 60.96,46.99 59.69,45.72 CS8.21 47.62,45.72 46.67,44.77 42.86,44.77 40.64,42.55 40.64,37.78 31.11,28.26 IC1.A10
A11
  Bottom 0.406: IC4.5-I 238.76,44.45 237.49,43.18 CS1.19 215.9,43.18 214.63,44.45 213.36,44.45 212.09,43.18 CS2.19 190.5,43.18 189.23,44.45 187.96,44.45 186.69,43.18 CS3.19 165.1,43.18 163.83,44.45 162.56,44.45 161.29,43.18 CS4.19 139.7,43.18 138.43,44.45 137.16,44.45 135.89,43.18 CS5.19 114.3,43.18 113.03,44.45 111.76,44.45 110.49,43.18 CS6.19 88.9,43.18 87.63,44.45 86.36,44.45 85.09,43.18 CS7.19 63.5,43.18 62.23,44.45 60.96,44.45 59.69,43.18 CS8.19 47.31,43.18 46.35,42.23 42.86,42.23 41.59,40.96 41.59,36.2 31.11,25.72 IC1.A11
A12
  Bottom 0.406: IC4.6-I 238.76,41.91 237.49,40.64 CS1.17 215.9,40.64 214.63,41.91 213.36,41.91 212.09,40.64 CS2.17 190.5,40.64 189.23,41.91 187.96,41.91 186.69,40.64 CS3.17 165.1,40.64 163.83,41.91 162.56,41.91 161.29,40.64 CS4.17 139.7,40.64 138.43,41.91 137.16,41.91 135.89,40.64 CS5.17 114.3,40.64 113.03,41.91 111.76,41.91 110.49,40.64 CS6.17 88.9,40.64 87.63,41.91 86.36,41.91 85.09,40.64 CS7.17 63.5,40.64 62.23,41.91 60.96,41.91 59.69,40.64 CS8.17 52.07,40.64 51.12,39.69 51.12,30.48 48.9,28.26 IC1.A12
A13
  Bottom 0.406: IC4.7-I 238.76,39.37 237.49,38.1 CS1.15 215.9,38.1 214.63,39.37 213.36,39.37 212.09,38.1 CS2.15 190.5,38.1 189.23,39.37 187.96,39.37 186.69,38.1 CS3.15 165.1,38.1 163.83,39.37 162.56,39.37 161.29,38.1 CS4.15 139.7,38.1 138.43,39.37 137.16,39.37 135.89,38.1 CS5.15 114.3,38.1 113.03,39.37 111.76,39.37 110.49,38.1 CS6.15 88.9,38.1 87.63,39.37 86.36,39.37 85.09,38.1 CS7.15 63.5,38.1 62.23,39.37 60.33,39.37 CS8.15 53.02,38.1 52.39,37.47 52.39,29.84 49.53,26.99 43.18,26.99 42.23,27.94 42.23,30.16 42.86,30.8 IC1.A13
A14
  Top 0.406: CS8.13 49.21,35.56 47.62,37.15 42.86,37.15 42.23,36.51 42.23,33.66 42.55,33.34 IC1.A14
  Bottom 0.406: IC4.8-I 238.44,36.83 237.17,35.56 CS1.13 215.9,35.56 214.63,36.83 213.36,36.83 212.09,35.56 CS2.13 190.5,35.56 189.23,36.83 187.96,36.83 186.69,35.56 CS3.13 165.1,35.56 163.83,36.83 162.56,36.83 161.29,35.56 CS4.13 139.7,35.56 138.43,36.83 137.16,36.83 135.89,35.56 CS5.13 114.3,35.56 113.03,36.83 111.76,36.83 110.49,35.56 CS6.13 88.9,35.56 87.63,36.83 86.36,36.83 85.09,35.56 CS7.13 63.5,35.56 62.23,36.83 60.96,36.83 59.69,35.56 CS8.13
A15
  Top 0.406: CS8.11 49.85,33.02 46.99,35.88 IC1.A15
  Bottom 0.406: IC4.9-I 238.76,34.29 237.49,33.02 CS1.11 215.9,33.02 214.63,34.29 213.36,34.29 212.09,33.02 CS2.11 190.5,33.02 189.23,34.29 187.96,34.29 186.69,33.02 CS3.11 165.1,33.02 163.83,34.29 162.56,34.29 161.29,33.02 CS4.11 139.7,33.02 138.43,34.29 137.16,34.29 135.89,33.02 CS5.11 114.3,33.02 113.03,34.29 111.76,34.29 110.49,33.02 CS6.11 88.9,33.02 87.63,34.29 86.36,34.29 85.09,33.02 CS7.11 63.5,33.02 62.23,34.29 60.96,34.29 59.69,33.02 CS8.11
D0
  Top 0.406: CS8.38 60.96,66.04 59.69,64.77 55.56,64.77 46.99,56.2 IC1.D0
  Bottom 0.406: CS1.38 238.76,66.04 237.49,64.77 215.9,64.77 214.63,66.04 CS2.38 213.36,66.04 212.09,64.77 190.5,64.77 189.23,66.04 CS3.38 187.96,66.04 186.69,64.77 165.1,64.77 163.83,66.04 CS4.38 162.56,66.04 161.29,64.77 139.7,64.77 138.43,66.04 CS5.38 137.16,66.04 135.89,64.77 114.3,64.77 113.03,66.04 CS6.38 111.76,66.04 110.49,64.77 88.9,64.77 87.63,66.04 CS7.38 86.36,66.04 85.09,64.77 63.5,64.77 62.23,66.04 CS8.38
D1
  Top 0.406: CS8.36 60.96,63.5 59.69,62.23 55.56,62.23 46.99,53.66 IC1.D1
  Bottom 0.406: CS1.36 238.76,63.5 237.49,62.23 215.9,62.23 214.63,63.5 CS2.36 213.36,63.5 212.09,62.23 190.5,62.23 189.23,63.5 CS3.36 187.96,63.5 186.69,62.23 165.1,62.23 163.83,63.5 CS4.36 162.56,63.5 161.29,62.23 139.7,62.23 138.43,63.5 CS5.36 137.16,63.5 135.89,62.23 114.3,62.23 113.03,63.5 CS6.36 111.76,63.5 110.49,62.23 88.9,62.23 87.63,63.5 CS7.36 86.36,63.5 85.09,62.23 63.5,62.23 62.23,63.5 CS8.36
D2
  Top 0.406: CS8.34 60.96,60.96 59.69,59.69 55.56,59.69 46.99,51.12 IC1.D2
  Bottom 0.406: CS1.34 238.76,60.96 237.49,59.69 215.9,59.69 214.63,60.96 CS2.34 213.36,60.96 212.09,59.69 190.5,59.69 189.23,60.96 CS3.34 187.96,60.96 186.69,59.69 165.1,59.69 163.83,60.96 CS4.34 162.56,60.96 161.29,59.69 139.7,59.69 138.43,60.96 CS5.34 137.16,60.96 135.89,59.69 114.3,59.69 113.03,60.96 CS6.34 111.76,60.96 110.49,59.69 88.9,59.69 87.63,60.96 CS7.34 86.36,60.96 85.09,59.69 63.5,59.69 62.23,60.96 CS8.34
D3
  Top 0.406: CS8.32 60.96,58.42 59.69,57.15 55.24,57.15 46.67,48.58 IC1.D3
  Bottom 0.406: CS1.32 238.76,58.42 237.49,57.15 215.9,57.15 214.63,58.42 CS2.32 213.36,58.42 212.09,57.15 190.5,57.15 189.23,58.42 CS3.32 187.96,58.42 186.69,57.15 165.1,57.15 163.83,58.42 CS4.32 162.56,58.42 161.29,57.15 139.7,57.15 138.43,58.42 CS5.32 137.16,58.42 135.89,57.15 114.3,57.15 113.03,58.42 CS6.32 111.76,58.42 110.49,57.15 88.9,57.15 87.63,58.42 CS7.32 86.36,58.42 85.09,57.15 63.5,57.15 62.23,58.42 CS8.32
D4
  Top 0.406: CS8.30 60.96,55.88 59.69,54.61 55.56,54.61 46.99,46.04 IC1.D4
  Bottom 0.406: CS1.30 238.76,55.88 237.49,54.61 215.9,54.61 214.63,55.88 CS2.30 213.36,55.88 212.09,54.61 190.5,54.61 189.23,55.88 CS3.30 187.96,55.88 186.69,54.61 165.1,54.61 163.83,55.88 CS4.30 162.56,55.88 161.29,54.61 139.7,54.61 138.43,55.88 CS5.30 137.16,55.88 135.89,54.61 114.3,54.61 113.03,55.88 CS6.30 111.76,55.88 110.49,54.61 88.9,54.61 87.63,55.88 CS7.30 86.36,55.88 85.09,54.61 63.5,54.61 62.23,55.88 CS8.30
D5
  Top 0.406: CS8.28 60.96,53.34 59.69,52.07 55.56,52.07 46.99,43.5 IC1.D5
  Bottom 0.406: CS1.28 238.76,53.34 237.49,52.07 215.9,52.07 214.63,53.34 CS2.28 213.36,53.34 212.09,52.07 190.5,52.07 189.23,53.34 CS3.28 187.96,53.34 186.69,52.07 165.1,52.07 163.83,53.34 CS4.28 162.56,53.34 161.29,52.07 139.7,52.07 138.43,53.34 CS5.28 137.16,53.34 135.89,52.07 114.3,52.07 113.03,53.34 CS6.28 111.76,53.34 110.49,52.07 88.9,52.07 87.63,53.34 CS7.28 86.36,53.34 85.09,52.07 63.5,52.07 62.23,53.34 CS8.28
D6
  Top 0.406: CS8.26 60.96,50.8 59.69,49.53 55.56,49.53 46.99,40.96 IC1.D6
  Bottom 0.406: CS1.26 238.92,50.8 237.65,49.53 215.9,49.53 214.63,50.8 CS2.26 213.36,50.8 212.09,49.53 190.5,49.53 189.23,50.8 CS3.26 187.96,50.8 186.69,49.53 165.1,49.53 163.83,50.8 CS4.26 162.56,50.8 161.29,49.53 139.7,49.53 138.43,50.8 CS5.26 137.16,50.8 135.89,49.53 114.3,49.53 113.03,50.8 CS6.26 111.76,50.8 110.49,49.53 88.9,49.53 87.63,50.8 CS7.26 86.36,50.8 85.09,49.53 63.5,49.53 62.23,50.8 CS8.26
D7
  Top 0.406: CS8.24 60.96,48.26 59.69,46.99 55.56,46.99 46.99,38.42 IC1.D7
  Bottom 0.406: CS1.24 238.76,48.26 237.49,46.99 215.9,46.99 214.63,48.26 CS2.24 213.36,48.26 212.09,46.99 190.5,46.99 189.23,48.26 CS3.24 187.96,48.26 186.69,46.99 165.1,46.99 163.83,48.26 CS4.24 162.56,48.26 161.29,46.99 139.7,46.99 138.43,48.26 CS5.24 137.16,48.26 135.89,46.99 114.3,46.99 113.03,48.26 CS6.24 111.76,48.26 110.49,46.99 88.9,46.99 87.63,48.26 CS7.24 86.36,48.26 85.09,46.99 63.5,46.99 62.23,48.26 CS8.24
GND
  Top 0.406: C2.2 C4.2 10.16,48.58 9.53,49.21 | JP2.7 8.26,55.88 8.57,56.2 IC3.7
  pour Top (isolate 0.254): 267.97,88.9 267.97,0 0,0 0,88.9
IRQ_LED
  Top 0.406: R10.2 JP3.1
IRQ_SIG
  Top 0.406: R10.1 11.75,17.78 21.27,17.78 23.81,20.32 23.81,26.99 23.18,27.62 IC2.10
IRQB  (via drill 0.7)
  Top 0.406: IC1.IRQB R8.1 23.81,63.82 21.91,61.91 21.91,54.93 20,53.02 20,46.67 25.08,41.91 25.08,30.16 v25.72,29.53 v53.66,29.53
  Bottom 0.406: CS1.14 238.76,35.56 237.49,34.29 215.9,34.29 214.63,35.56 CS2.14 213.36,35.56 212.09,34.29 190.5,34.29 189.23,35.56 CS3.14 187.96,35.56 186.69,34.29 165.1,34.29 163.83,35.56 CS4.14 162.56,35.56 161.29,34.29 139.7,34.29 138.43,35.56 CS5.14 137.16,35.56 135.89,34.29 114.3,34.29 113.03,35.56 CS6.14 111.76,35.56 110.49,34.29 88.9,34.29 87.63,35.56 CS7.14 86.36,35.56 85.09,34.29 63.5,34.29 62.23,35.56 CS8.14 60.96,35.56 59.69,34.29 58.42,34.29 v53.66,29.53 | IC2.11 25.08,30.16 v25.72,29.53
N$1
  Bottom 0.406: JP9.1 244.79,73.03 R2.2
N$2
  Bottom 0.406: IC2.4 IC2.5
N$3
  Bottom 0.406: IC2.9 IC2.6 R3.2
N$4
  Top 0.406: C2.1 6.99,41.91 R7.2 Q1.2 7.62,35.88 5.71,33.97 5.71,30.8 8.57,27.94 R3.1
N$5
  Top 0.406: C4.1 R7.1 10.16,37.78 | 10.16,37.78 10.16,33.78 Q1.1 | IC2.1 10.16,37.78
N$6
  Top 0.406: IC3.2 6.35,70.48 6.03,70.17 6.03,60.64 6.35,60.33 IC3.6
N$7
  Bottom 0.406: IC2.2 IC2.3
N$8
  Top 0.406: IC3.8 14.29,57.78 13.65,58.42 13.65,67.63 13.97,67.94 IC3.12
N$15  (via drill 0.7)
  Top 0.406: v48.9,69.85 48.9,65.72 46.99,63.82 IC1.BE
  Bottom 0.406: R4.1 v48.9,69.85
N$16
  Bottom 0.406: R6.1 47.31,74.61 47.31,69.85 46.35,68.9 IC1.SOB
NMI_LED
  Top 0.406: R11.2 JP3.3
NMI_SIG
  Top 0.406: IC2.12 19.68,32.7 18.73,31.75 18.73,22.23 R11.1
NMIB  (via drill 0.7)
  Top 0.406: CS8.16 60.33,36.83 60.33,32.07 60.01,31.75 57.15,31.75 56.83,32.07 42.23,32.07 39.69,34.61 27.3,34.61 v26.67,35.24 26.67,49.21 R9.1 24.13,53.98 23.5,54.61 23.5,57.47 27.3,61.28 IC1.NMIB
  Bottom 0.406: CS1.16 238.76,38.1 237.49,36.83 215.9,36.83 214.63,38.1 CS2.16 213.36,38.1 212.09,36.83 190.5,36.83 189.23,38.1 CS3.16 187.96,38.1 186.69,36.83 165.1,36.83 163.83,38.1 CS4.16 162.56,38.1 161.29,36.83 139.7,36.83 138.43,38.1 CS5.16 137.16,38.1 135.89,36.83 114.3,36.83 113.03,38.1 CS6.16 111.76,38.1 110.49,36.83 88.9,36.83 87.63,38.1 CS7.16 86.36,38.1 85.09,36.83 63.5,36.83 62.23,38.1 CS8.16 | IC2.13 v26.67,35.24
OSC  (via drill 0.7)
  Top 0.406: v16.83,22.54 16.83,42.55 12.06,47.31 12.06,52.07 JP2.5 10.79,58.74 11.11,59.05 11.11,67.31 10.48,67.94 IC3.3
  Bottom 0.254: 111.76,25.4 CS6.6 113.03,25.4
  Bottom 0.406: 111.76,25.4 110.49,24.13 88.9,24.13 87.63,25.4 CS7.6 86.36,25.4 85.09,24.13 63.5,24.13 62.23,25.4 CS8.6 60.96,25.4 59.69,24.13 24.77,24.13 23.18,22.54 IC2.8 v16.83,22.54 | 113.03,25.4 114.3,24.13 135.89,24.13 137.16,25.4 CS5.6 138.43,25.4 139.7,24.13 161.29,24.13 162.56,25.4 CS4.6 163.83,25.4 165.1,24.13 186.69,24.13 187.96,25.4 CS3.6 189.23,25.4 190.5,24.13 212.09,24.13 213.36,25.4 CS2.6 214.63,25.4 215.9,24.13 237.49,24.13 238.76,25.4 CS1.6
PHI2  (via drill 0.7)
  Top 0.406: CS8.20 63.18,43.18 64.45,44.45 64.45,69.85 63.18,71.12 46.99,71.12 46.04,70.17 42.55,70.17 41.91,69.53 41.91,66.36 | IC1.PHI2 41.91,66.36 | 41.91,66.36 35.24,66.36 31.43,62.55 25.72,62.55 v24.45,61.28
  Bottom 0.254: 137.16,43.18 CS5.20 138.43,43.18
  Bottom 0.406: 138.43,43.18 139.7,41.91 161.29,41.91 162.56,43.18 CS4.20 163.83,43.18 165.1,41.91 186.69,41.91 187.96,43.18 CS3.20 189.23,43.18 190.5,41.91 212.09,41.91 213.36,43.18 CS2.20 214.63,43.18 215.9,41.91 237.49,41.91 238.76,43.18 CS1.20 251.78,43.18 252.41,43.81 252.41,53.98 251.78,54.61 IC4.1-I/CLK | 137.16,43.18 135.89,41.91 114.3,41.91 113.03,43.18 CS6.20 111.76,43.18 110.49,41.91 88.9,41.91 87.63,43.18 CS7.20 86.36,43.18 85.09,41.91 63.5,41.91 62.23,43.18 CS8.20 | v24.45,61.28 21.59,61.28 18.73,58.42 18.73,56.83 17.78,55.88 17.78,52.39 16.19,50.8 JP2.2 JP2.4 JP2.6 JP2.8
RDY  (via drill 0.7)
  Top 0.406: R5.1 IC1.RDY 31.11,71.44 35.24,75.56 46.67,75.56 47.62,74.61 62.23,74.61 66.36,70.48 66.36,32.7 v65.41,31.75
  Bottom 0.406: CS1.12 238.76,33.02 237.49,31.75 215.9,31.75 214.63,33.02 CS2.12 213.36,33.02 212.09,31.75 190.5,31.75 189.23,33.02 CS3.12 187.96,33.02 186.69,31.75 165.1,31.75 163.83,33.02 CS4.12 162.56,33.02 161.29,31.75 139.7,31.75 138.43,33.02 CS5.12 137.16,33.02 135.89,31.75 114.3,31.75 113.03,33.02 CS6.12 111.76,33.02 110.49,31.75 88.9,31.75 87.63,33.02 CS7.12 86.36,33.02 85.09,31.75 v65.41,31.75 63.5,31.75 62.23,33.02 CS8.12
RESB
  Top 0.406: CS8.18 63.18,40.64 65.41,42.86 65.41,70.17 63.5,72.07 47.94,72.07 46.04,73.98 IC1.RESB
  Bottom 0.406: CS8.18 62.23,40.64 63.5,39.37 85.09,39.37 86.36,40.64 CS7.18 87.63,40.64 88.9,39.37 110.49,39.37 111.76,40.64 CS6.18 113.03,40.64 114.3,39.37 135.89,39.37 137.16,40.64 CS5.18 138.43,40.64 139.7,39.37 161.29,39.37 162.56,40.64 CS4.18 163.83,40.64 165.1,39.37 186.69,39.37 187.96,40.64 CS3.18 189.23,40.64 190.5,39.37 212.09,39.37 213.36,40.64 CS2.18 214.63,40.64 215.9,39.37 237.49,39.37 238.76,40.64 CS1.18 252.41,40.64 253.37,41.59 253.37,54.61 246.7,61.28 R1.1 246.7,72.07 247.33,72.71 JP9.2
RWB
  Top 0.406: CS8.22 63.18,45.72 63.5,46.04 63.5,69.53 62.87,70.17 58.42,70.17 46.99,58.74 IC1.RWB
  Bottom 0.406: CS1.22 238.76,45.72 237.49,44.45 215.9,44.45 214.63,45.72 CS2.22 213.36,45.72 212.09,44.45 190.5,44.45 189.23,45.72 CS3.22 187.96,45.72 186.69,44.45 165.1,44.45 163.83,45.72 CS4.22 162.56,45.72 161.29,44.45 139.7,44.45 138.43,45.72 CS5.22 137.16,45.72 135.89,44.45 114.3,44.45 113.03,45.72 CS6.22 111.76,45.72 110.49,44.45 88.9,44.45 87.63,45.72 CS7.22 86.36,45.72 85.09,44.45 63.5,44.45 62.23,45.72 CS8.22
VCC  (via drill 0.7 pad 1.7)
  Top 1.27: v87,17.14 CS7.2 CS7.4 | CS5.4 CS5.2 | CS6.4 CS6.2 | CS2.4 CS2.2 | CS3.2 CS3.4 | CS4.2 CS4.4 | CS1.4 CS1.2
  Bottom 0.813: 264.16,64.77 R1.2 256.86,61.59 C1.1 IC4.VCC
  Bottom 1.016: C3.+ 93.03,11.11
  Bottom 1.27: CS5.2 137.79,11.11 | CS6.2 112.39,11.11 | CS2.2 214,11.11 | CS4.2 163.19,11.11 | CS3.2 188.59,11.11 | CS1.2 239.4,11.11 | 61.59,11.11 CS8.2 CS8.4 | v87,17.14 87,11.11
  Bottom 3.81: 264.16,71.12 264.16,83.5 245.75,83.5 240.35,78.11 80.64,78.11 78.74,80.01 46.35,80.01 45.09,78.74 29.21,78.74 23.5,84.45 3.17,84.45 3.17,10.79 8.89,5.08 22.23,5.08 28.26,11.11 61.59,11.11 87,11.11 93.03,11.11 112.39,11.11 137.79,11.11 163.19,11.11 188.59,11.11 214,11.11 239.4,11.11 252.41,11.11 264.16,22.86 264.16,64.77 264.16,71.12 | 264.16,71.12 264.12,71.16 X1.1
  pour Bottom (isolate 0.254): 0,88.9 267.97,88.9 267.97,-0.32 0,-0.32

### Text on the board
tNames: IRQ_LED | NMI_LED
tValues: - | + | Backplane V3.1 / by Jennifer Gunn. | JP1 Settings. / 1-2 1MHz / 3-4 2MHz / 5-6 4MHz / 7=GND, 8=OSC